# Altium schematic sheet SCH_Controller.SchDoc
size A
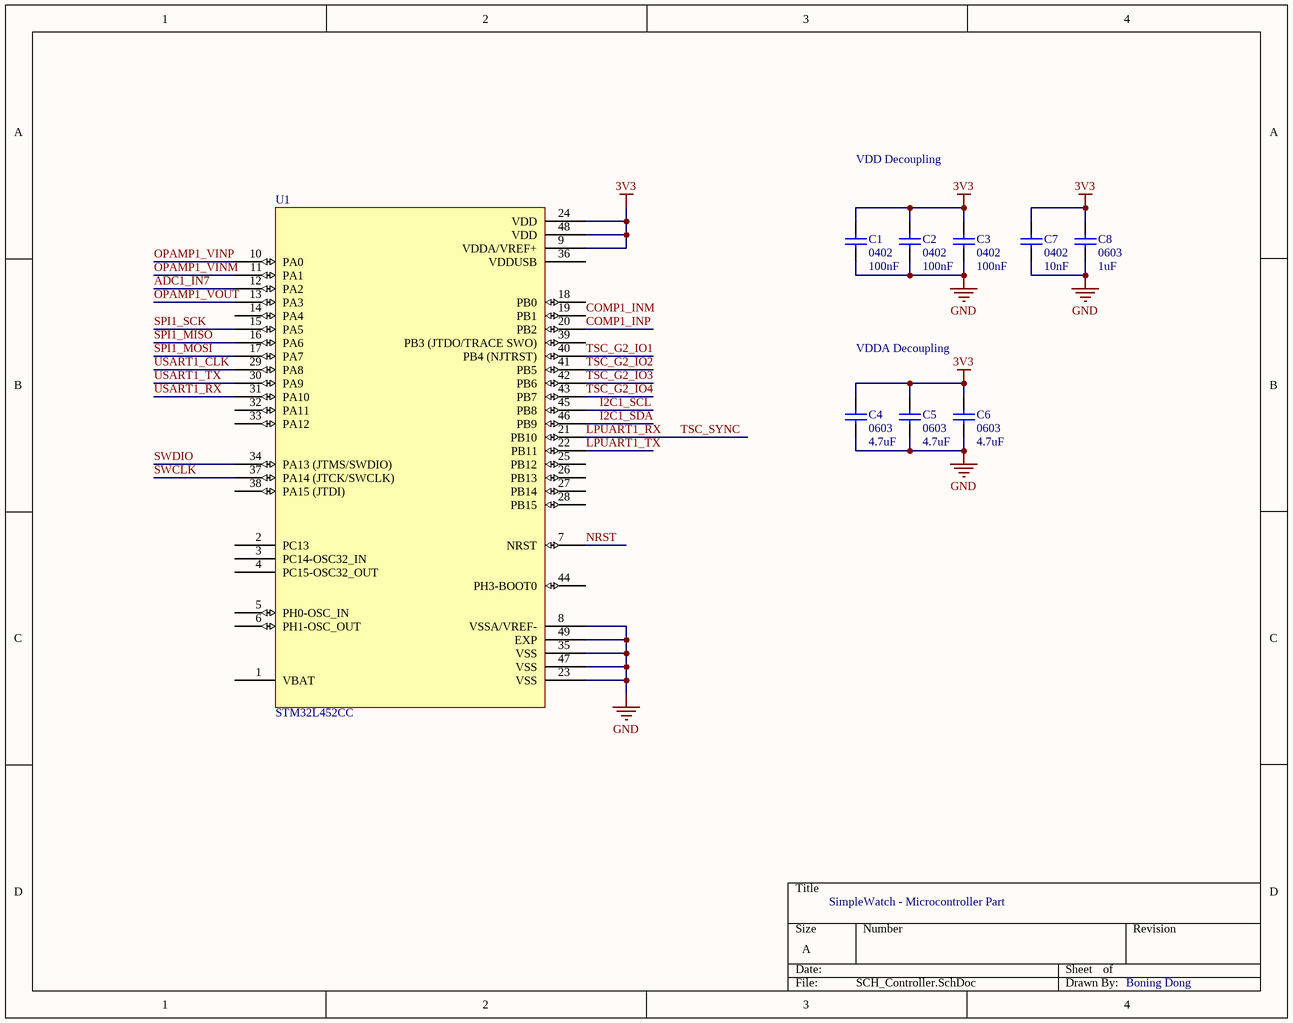
[diagram p0: SCH_Controller.SchDoc]

## Parts
C1  0402  value 100nF  [RAD-0.3]
C2  0402  value 100nF  [RAD-0.3]
C3  0402  value 100nF  [RAD-0.3]
C4  0603  value 4.7uF  [RAD-0.3]
C5  0603  value 4.7uF  [RAD-0.3]
C6  0603  value 4.7uF  [RAD-0.3]
C7  0402  value 10nF  [RAD-0.3]
C8  0603  value 1uF  [RAD-0.3]
U1  STM32L452CC

## Nets
3V3: C1.2 C2.2 C3.2 C4.2 C5.2 C6.2 C7.2 C8.2 U1.9(VDDA/VREF+) U1.24(VDD) U1.48(VDD)
GND: C1.1 C2.1 C3.1 C4.1 C5.1 C6.1 C7.1 C8.1 U1.8(VSSA/VREF-) U1.23(VSS) U1.35(VSS) U1.47(VSS) U1.49(EXP)
ADC1_IN7: U1.12(PA2)
COMP1_INM: U1.19(PB1)
COMP1_INP: U1.20(PB2)
I2C1_SCL: U1.45(PB8)
I2C1_SDA: U1.46(PB9)
LPUART1_RX: U1.21(PB10)  [also labelled TSC_SYNC]
LPUART1_TX: U1.22(PB11)
NRST: U1.7(NRST)
OPAMP1_VINM: U1.11(PA1)
OPAMP1_VINP: U1.10(PA0)
OPAMP1_VOUT: U1.13(PA3)
SPI1_MISO: U1.16(PA6)
SPI1_MOSI: U1.17(PA7)
SPI1_SCK: U1.15(PA5)
SWCLK: U1.37(PA14_(JTCK/SWCLK))
SWDIO: U1.34(PA13_(JTMS/SWDIO))
TSC_G2_IO1: U1.40(PB4_(NJTRST))
TSC_G2_IO2: U1.41(PB5)
TSC_G2_IO3: U1.42(PB6)
TSC_G2_IO4: U1.43(PB7)
USART1_CLK: U1.29(PA8)
USART1_RX: U1.31(PA10)
USART1_TX: U1.30(PA9)

Not connected (* = marked no-connect by the designer): U1 1(VBAT) 2(PC13) 3(PC14-OSC32_IN) 4(PC15-OSC32_OUT) 5(PH0-OSC_IN) 6(PH1-OSC_OUT) 14(PA4) 18(PB0) 25(PB12) 26(PB13) 27(PB14) 28(PB15) 32(PA11) 33(PA12) 36(VDDUSB) 38(PA15_(JTDI)) 39(PB3_(JTDO/TRACE_SWO)) 44(PH3-BOOT0)

## Notes on the sheet
- VDD Decoupling
- VDDA Decoupling
- SimpleWatch - Microcontroller Part
- Boning Dong

## Library data of the parts
C1-C8 = Cap: Capacitor; Published: 8-Jun-2000; LatestRevisionDate: 17-Jul-2002; LatestRevisionNote: Re-released for DXP Platform.; PackageReference: RAD-0.3; Publisher: Altium Limited; PackageDescription: Radial Cap, Thru-Hole; 2 Leads; 0.3 in Pin Spacing
U1 = STM32L452CX: ARM® Cortex®-M4 STM32L4 Microcontroller IC 32-Bit 80MHz 512KB (512K x 8) FLASH 48-UFQFPN (7x7)